# Altium schematic sheet Scholar Robotic SCH.SchDoc
size A; SheetNumber: 1; SheetTotal: 1
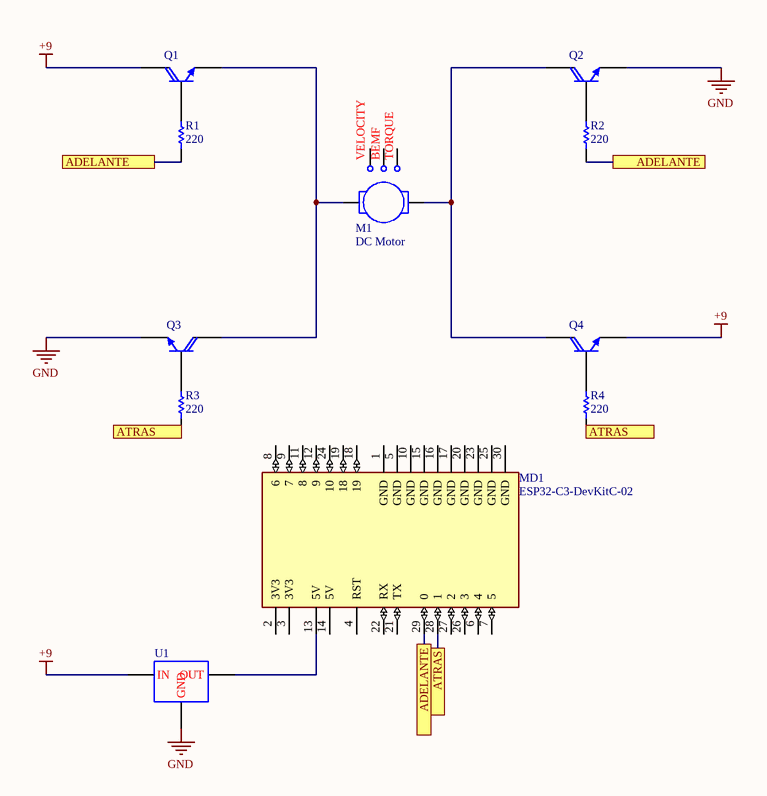
[diagram p0: Scholar Robotic SCH.SchDoc]

## Parts
M1  DC Motor
MD1  ESP32-C3-DevKitC-02  [FP-ESP32-C3-DevKitC-02-MFG]
Q1  Darlington NPN Bipolar Transistor  (value not drawn)
Q2  Darlington NPN Bipolar Transistor  (value not drawn)
Q3  Darlington NPN Bipolar Transistor  (value not drawn)
Q4  Darlington NPN Bipolar Transistor  (value not drawn)
R1  value 220  (hidden comment: Resistor)
R2  value 220  (hidden comment: Resistor)
R3  value 220  (hidden comment: Resistor)
R4  value 220  (hidden comment: Resistor)
U1  Positive Fixed Voltage regulator  (value not drawn)

## Ports
ADELANTE, ATRAS

## Nets
+9: Q1.1(C) Q4.3(E) U1.1(IN)
GND: Q2.3(E) Q3.3(E) U1.2(GND)
ADELANTE: MD1.29(0) R1.1 R2.1 ; port ADELANTE
ATRAS: MD1.28(1) R3.1 R4.1 ; port ATRAS
NetM1_1: M1.1 Q1.3(E) Q3.1(C)
NetM1_2: M1.2 Q2.1(C) Q4.1(C)
NetMD1_13: MD1.13(5V) U1.3(OUT)
NetQ1_2: Q1.2(B) R1.2
NetQ2_2: Q2.2(B) R2.2
NetQ3_2: Q3.2(B) R3.2
NetQ4_2: Q4.2(B) R4.2

Not connected (* = marked no-connect by the designer): M1 3 4 5; MD1 1(GND) 2(3V3) 3(3V3) 4(RST) 5(GND) 6(4) 7(5) 8(6) 9(7) 10(GND) 11(8) 12(9) 14(5V) 15(GND) 16(GND) 17(GND) 18(19) 19(18) 20(GND) 21(TX) 22(RX) 23(GND) 24(10) 25(GND) 26(3) 27(2) 30(GND)

## Notes on the sheet
- (in symbol DC Motor) VELOCITY; BEMF; TORQUE

## Library data of the parts
M1 = DC Motor: LA: 1.5M; RA: 0.5; KE: 0.05; JM: 250U; BM: 0.1M; TL: 0; SimulationGenericComponent: True; KT: 0.05
MD1 = CMP-194061-000001-1: ESP32-C3-WROOM-02 DEV BRD
Q1-Q4 = Darlington BJT NPN: subs: 1; tnom: 27; is: 1e-16; bf: 100; vaf: 0; ne: 1.5; nc: 2; vje: 0.75; mje: 0.33; eg: 1.11; xti: 3; fc: 0.5; vbe_max: 1e99; SimulationGenericComponent: True; nf: 1; ikf: 0; ise: 0; br: 1; nr: 1; var: 0; ikr: 0; isc: 0; rb: 0; irb: 0; rbm: 0; re: 0; rc: 0; cje: 0; tf: 0; xtf: 0; vtf: 0; itf: 0; ptf: 0; cjc: 0; vjc: 0.75; mjc: 0.33; xcjc: 1; tr: 0; cjs: 0; vjs: 0.75; mjs: 0; xtb: 0; kf: 0; af: 0; iss: 0; ns: 1; tlev: 0; tlevc: 0; tbf1: 0; tbf2: 0; tbr1: 0; tbr2: 0; tikf1: 0; tikf2: 0; tikr1: 0; tikr2: 0; tirb1: 0; tirb2: 0; tnc1: 0; tnc2: 0; tne1: 0; tne2: 0; tnf1: 0; tnf2: 0; tnr1: 0; tnr2: 0; trb1: 0; trb2: 0; trc1: 0; trc2: 0; tre1: 0; tre2: 0; trm1: 0; trm2: 0; tvaf1: 0; tvaf2: 0; tvar1: 0; tvar2: 0; ctc: 0; cte: 0; cts: 0; tvjc: 0; tvje: 0; tvjs: 0; titf1: 0; titf2: 0; ttf1: 0; ttf2: 0; ttr1: 0; ttr2: 0; tmje1: 0; tmje2: 0; tmjc1: 0; tmjc2: 0; tmjs1: 0; tmjs2: 0; tns1: 0; tns2: 0; nkf: 0.5; tis1: 0; tis2: 0; tise1: 0; tise2: 0; tisc1: 0; tisc2: 0; vbc_max: 1e99; vce_max: 1e99; cn: 0; d: 0; gamma: 0; qco: 0; quasimod: 0; rco: 0; vg: 0; vo: 0
R1-R4 = Resistor: TC1: 0; SimulationGenericComponent: True; TC2: 0
U1 = Linear Voltage Regulator (Fixed): Av_feedback: 1665; R1_Value: 1020; SimulationGenericComponent: True